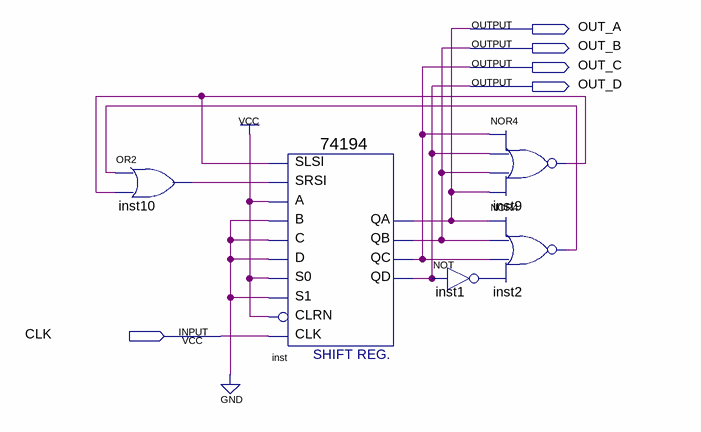
[diagram p0: schematic sheet]
// Quartus schematic Circular_74194.bdf as structural Verilog: 5 symbols, 5 pins
module Circular_74194 (
  input  CLK,
  output OUT_A,
  output OUT_B,
  output OUT_C,
  output OUT_D
);

  wire inst1_out, inst2_out, inst9_out, inst10_out;

  or inst10 (inst10_out, inst2_out, inst9_out);
  \74194  inst (
    .SLSI(inst9_out), .SRSI(inst10_out), .B(1'b0), .C(1'b0), .CLK(CLK), .CLRN(1'b1), .D(1'b0), .S1(1'b0),
    .S0(1'b1), .A(1'b1), .QA(OUT_A), .QB(OUT_B), .QC(OUT_C), .QD(OUT_D));
  not inst1 (inst1_out, OUT_D);
  nor inst9 (inst9_out, OUT_C, OUT_D, OUT_B, OUT_A);
  nor inst2 (inst2_out, OUT_A, OUT_B, OUT_C, inst1_out);
endmodule
